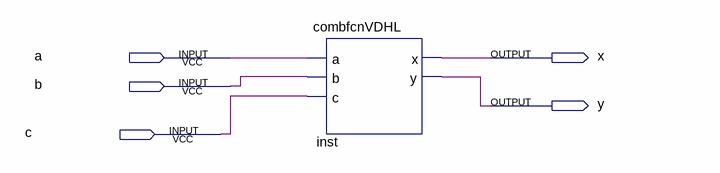
[diagram p0: schematic sheet]
// Quartus schematic combfcn.bdf as structural Verilog: 1 symbols, 5 pins
module combfcn (
  input  a,
  input  b,
  input  c,
  output x,
  output y
);

  combfcnVDHL inst (.a(a), .b(b), .c(c), .x(x), .y(y));
endmodule
